# Altium schematic sheet TSAL_Light.SchDoc
size A4; SheetNumber: 1; SheetTotal: 1
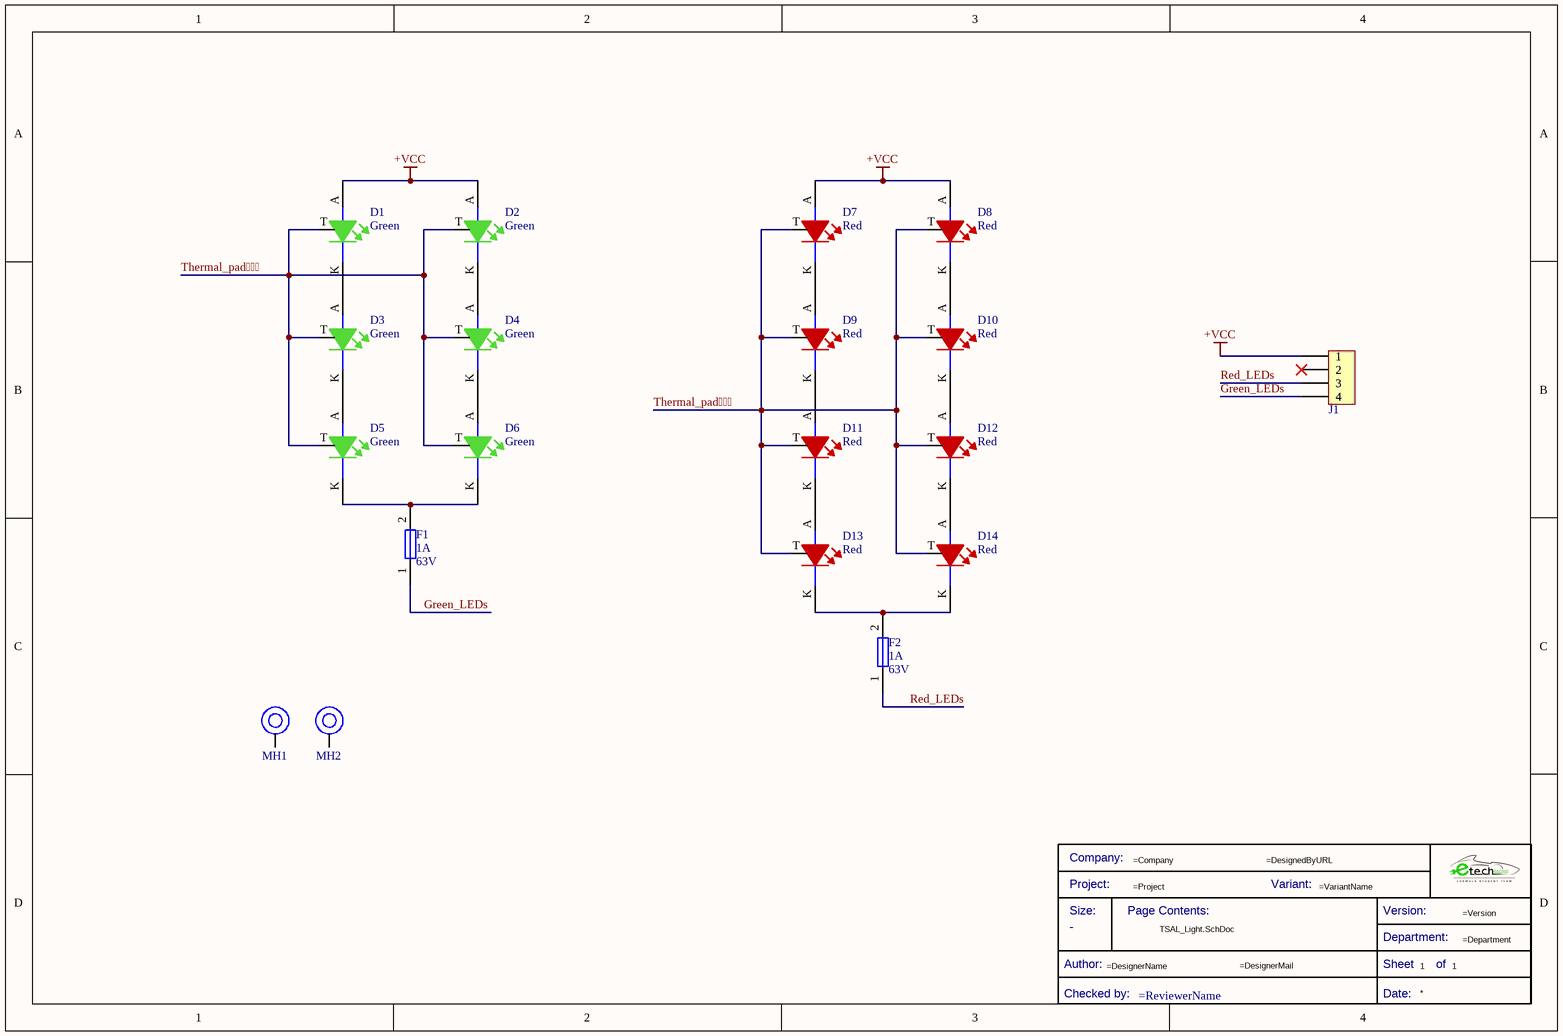
[diagram p0: TSAL_Light.SchDoc]

## Parts
*?  Title Block_template  (value not drawn)  (graphical)
D1  Color: Green  [LED_3535_WE]  (hidden comment: 150353GS74500)
D2  Color: Green  [LED_3535_WE]  (hidden comment: 150353GS74500)
D3  Color: Green  [LED_3535_WE]  (hidden comment: 150353GS74500)
D4  Color: Green  [LED_3535_WE]  (hidden comment: 150353GS74500)
D5  Color: Green  [LED_3535_WE]  (hidden comment: 150353GS74500)
D6  Color: Green  [LED_3535_WE]  (hidden comment: 150353GS74500)
D7  Color: Red  [LED_3535_WE]  (hidden comment: 150353RS74500)
D8  Color: Red  [LED_3535_WE]  (hidden comment: 150353RS74500)
D9  Color: Red  [LED_3535_WE]  (hidden comment: 150353RS74500)
D10  Color: Red  [LED_3535_WE]  (hidden comment: 150353RS74500)
D11  Color: Red  [LED_3535_WE]  (hidden comment: 150353RS74500)
D12  Color: Red  [LED_3535_WE]  (hidden comment: 150353RS74500)
D13  Color: Red  [LED_3535_WE]  (hidden comment: 150353RS74500)
D14  Color: Red  [LED_3535_WE]  (hidden comment: 150353RS74500)
F1  Current Rating: 1A  Voltage Rating (DC): 63V  [Fuse_1206]  (hidden comment: 0437001.WRA)
F2  Current Rating: 1A  Voltage Rating (DC): 63V  [Fuse_1206]  (hidden comment: 0437001.WRA)
J1  1053131204  [J_NanoFit_1x4]  (value not drawn)
MH1  Mounting_Hole_M3  [Mounting_Hole_M3]  (value not drawn)
MH2  Mounting_Hole_M3  [Mounting_Hole_M3]  (value not drawn)

## Nets
+VCC: D1.A D2.A D7.A D8.A J1.1
Green_LEDs: F1.1 J1.4
Red_LEDs: F2.1 J1.3
Thermal_pad: D1.T D2.T D3.T D4.T D5.T D6.T D7.T D8.T D9.T D10.T D11.T D12.T D13.T D14.T
NetD1_K: D1.K D3.A
NetD2_K: D2.K D4.A
NetD3_K: D3.K D5.A
NetD4_K: D4.K D6.A
NetD5_K: D5.K D6.K F1.2
NetD7_K: D7.K D9.A
NetD8_K: D8.K D10.A
NetD9_K: D9.K D11.A
NetD10_K: D10.K D12.A
NetD11_K: D11.K D13.A
NetD12_K: D12.K D14.A
NetD13_K: D13.K D14.K F2.2

Not connected (* = marked no-connect by the designer): J1 2*; MH1 1; MH2 1

## Notes on the sheet
- (in symbol Title Block_template) Company:; Project:; Variant:; Size:; Page Contents:; Version:; Department:; Author:; Sheet; of; Checked by:; Date:

## Library data of the parts
*? = Title Block_template: Standard Title Block; .Creator: GP; Category: Title Block; .PCBcheck: GP; .SCHcheck: GP; Checked by:: =ReviewerName; Size: -
D1-D6 = LEDGS-3535-85: High Brightness LED, WL-SMDC Series, 525 nm, Green, 85 lm, 350 mA; Manufacturer: Wurth Electronics; Forward Current: 1A; Wavelength: 525nm; Test Temperature: 25°C; Viewing Angle: 125°; Thermal Resistance of Package: 8°C/W; Luminous Flux: 85lm; Test Current: 350mA; Forward Voltage: 3.4V; .Creator: GP; Supplier 1: Digi-Key; Manufacturer Part Number: 150353GS74500; RoHS: Yes; Pricing 1: 1=3,24000, 50=2,85700, 100=2,34700, 500=2,08000 (USD); Mount: Surface Mount; Case/Package: SMD/SMT; Packaging: Cut Tape; Max Current Rating: 1A; REACH SVHC: Unknown; RoHS Compliant: Yes; ComponentLink1URL: http://www.farnell.com/datasheets/1886832.pdf?src-supplier=Farnell; ComponentLink1Description: http://www.farnell.com/datasheets/1886832.pdf?src-supplier=Farnell; ComponentLink2URL: http://www.farnell.com/datasheets/1886832.pdf?src-supplier=Element14; ComponentLink2Description: http://www.farnell.com/datasheets/1886832.pdf?src-supplier=Element14; Supplier Part Number 1: 732-10350-1-ND; ComponentLink3Description: Where buy it; ComponentLink3URL: https://www.we-online.com/catalog/en/WL-SMDC?sq=150353rs74500&sp=https%3A%2F%2Fwww.we-online.com%2Fweb%2Fen%2Fwuerth_elektronik%2Fsearchpage.php%3Fsearch%3D150353rs74500#150353GS74500
D7-D14 = LEDRS-3535-55: High Brightness Led, Wl-Smdc Series, 625 Nm, Red, 55 Lm, 350 Ma; Manufacturer: Wurth Electronics; Forward Current: 700mA; Wavelength: 625nm; Test Temperature: 25°C; Viewing Angle: 125°; Thermal Resistance of Package: 10°C/W; Luminous Flux: 55lm; Test Current: 350mA; Forward Voltage: 2.2V; .Creator: GP; Supplier 1: RSComponents; Manufacturer Part Number: 150353RS74500; RoHS: Yes; Stock 1: 1; Pricing 1: 5=1,40500 (USD); Mount: Surface Mount; Case/Package: SMD/SMT; Packaging: Cut Tape; Max Current Rating: 700mA; REACH SVHC: Unknown; RoHS Compliant: Yes; ComponentLink1URL: http://www.farnell.com/datasheets/1886833.pdf?src-supplier=Farnell; ComponentLink1Description: http://www.farnell.com/datasheets/1886833.pdf?src-supplier=Farnell; ComponentLink2URL: http://www.farnell.com/datasheets/1886833.pdf?src-supplier=Element14; ComponentLink2Description: http://www.farnell.com/datasheets/1886833.pdf?src-supplier=Element14; Supplier Part Number 1: 9008911; ComponentLink3Description: Where buy it; ComponentLink3URL: https://www.we-online.com/catalog/en/WL-SMDC?sq=150353rs74500&sp=https%3A%2F%2Fwww.we-online.com%2Fweb%2Fen%2Fwuerth_elektronik%2Fsearchpage.php%3Fsearch%3D150353rs74500#150353RS74500
F1 F2 = Fuse_1A_63V_1206: Fuse Chip Fast Acting 1A 63V SMD Solder Pad 1206 Ceramic T/R Automotive; Manufacturer: Littelfuse; Fuse Type: Board Mount (Cartridge Style Excluded); Approvals: CSA,cURus; .Creator: DO; Supplier 1: Digi-Key; Manufacturer Part Number: 0437001.WRA; RoHS: Yes; Category: Fuses; Stock 1: 5820; Pricing 1: 1=1,52000, 5=1,47000, 10=1,37600, 50=1,13860, 100=0,94880, 250=0,92508, 500=0,78276, 1000=0,68788 (USD); Mount: Surface Mount; Case/Package: 1206; Case Code (Imperial): 1206; Case Code (Metric): 3216; Min Operating Temperature: -55°C; Max Operating Temperature: 150°C; Packaging: Tape and Reel; Voltage Rating (AC): 63V; ComponentLink1URL: https://www.littelfuse.com/~/media/electronics/datasheets/fuses/littelfuse_fuse_437a_datasheet.pdf.pdf?src-supplier=Digi-Key; ComponentLink1Description: https://www.littelfuse.com/~/media/electronics/datasheets/fuses/littelfuse_fuse_437a_datasheet.pdf.pdf?src-supplier=Digi-Key; Supplier Part Number 1: F10001CT-ND; ComponentLink2Description: Where buy it; ComponentLink2URL: https://www.mouser.es/ProductDetail/Littelfuse/0437001WRA?qs=DXv0QSHKF4z9CJhPXjxR%252BA%3D%3D
J1 = J_NanoFit_1x4: Nano-Fit Right Angle Header; Through Hole; 2.50mm; Single Row; 4 Circuit; Gold Plated; Manufacturer: Molex; Manufacturer Part Number: 105313-1204; Gender: Male; .Creator: DO; Supplier 1: RSComponents; RoHS: Yes; Category: Headers and Wire Housings; Stock 1: 286; Pricing 1: 10=1,14100, 50=0,65100, 100=0,63400, 250=0,61700, 500=0,60100 (GBP); Mount: Through Hole; Contact Plating: Gold; Contact Material: Brass; Color: Black; Termination: Through Hole; Number of Rows: 1; REACH SVHC: Unknown; RoHS Compliant: Yes; ComponentLink1URL: http://www.farnell.com/datasheets/2216599.pdf?src-supplier=Farnell; ComponentLink1Description: http://www.farnell.com/datasheets/2216599.pdf?src-supplier=Farnell; ComponentLink2URL: http://www.farnell.com/datasheets/2216599.pdf?src-supplier=Element14; ComponentLink2Description: http://www.farnell.com/datasheets/2216599.pdf?src-supplier=Element14; ComponentLink3URL: http://www.farnell.com/datasheets/2216599.pdf?src-supplier=Newark; ComponentLink3Description: http://www.farnell.com/datasheets/2216599.pdf?src-supplier=Newark; ComponentLink4URL: https://www.molex.com/pdm_docs/sd/1053131102_sd.pdf?src-supplier=Digi-Key; ComponentLink4Description: https://www.molex.com/pdm_docs/sd/1053131102_sd.pdf?src-supplier=Digi-Key; Supplier Part Number 1: 1225085